# EAGLE schematic ledControlpcb (EAGLE 6.6.0)
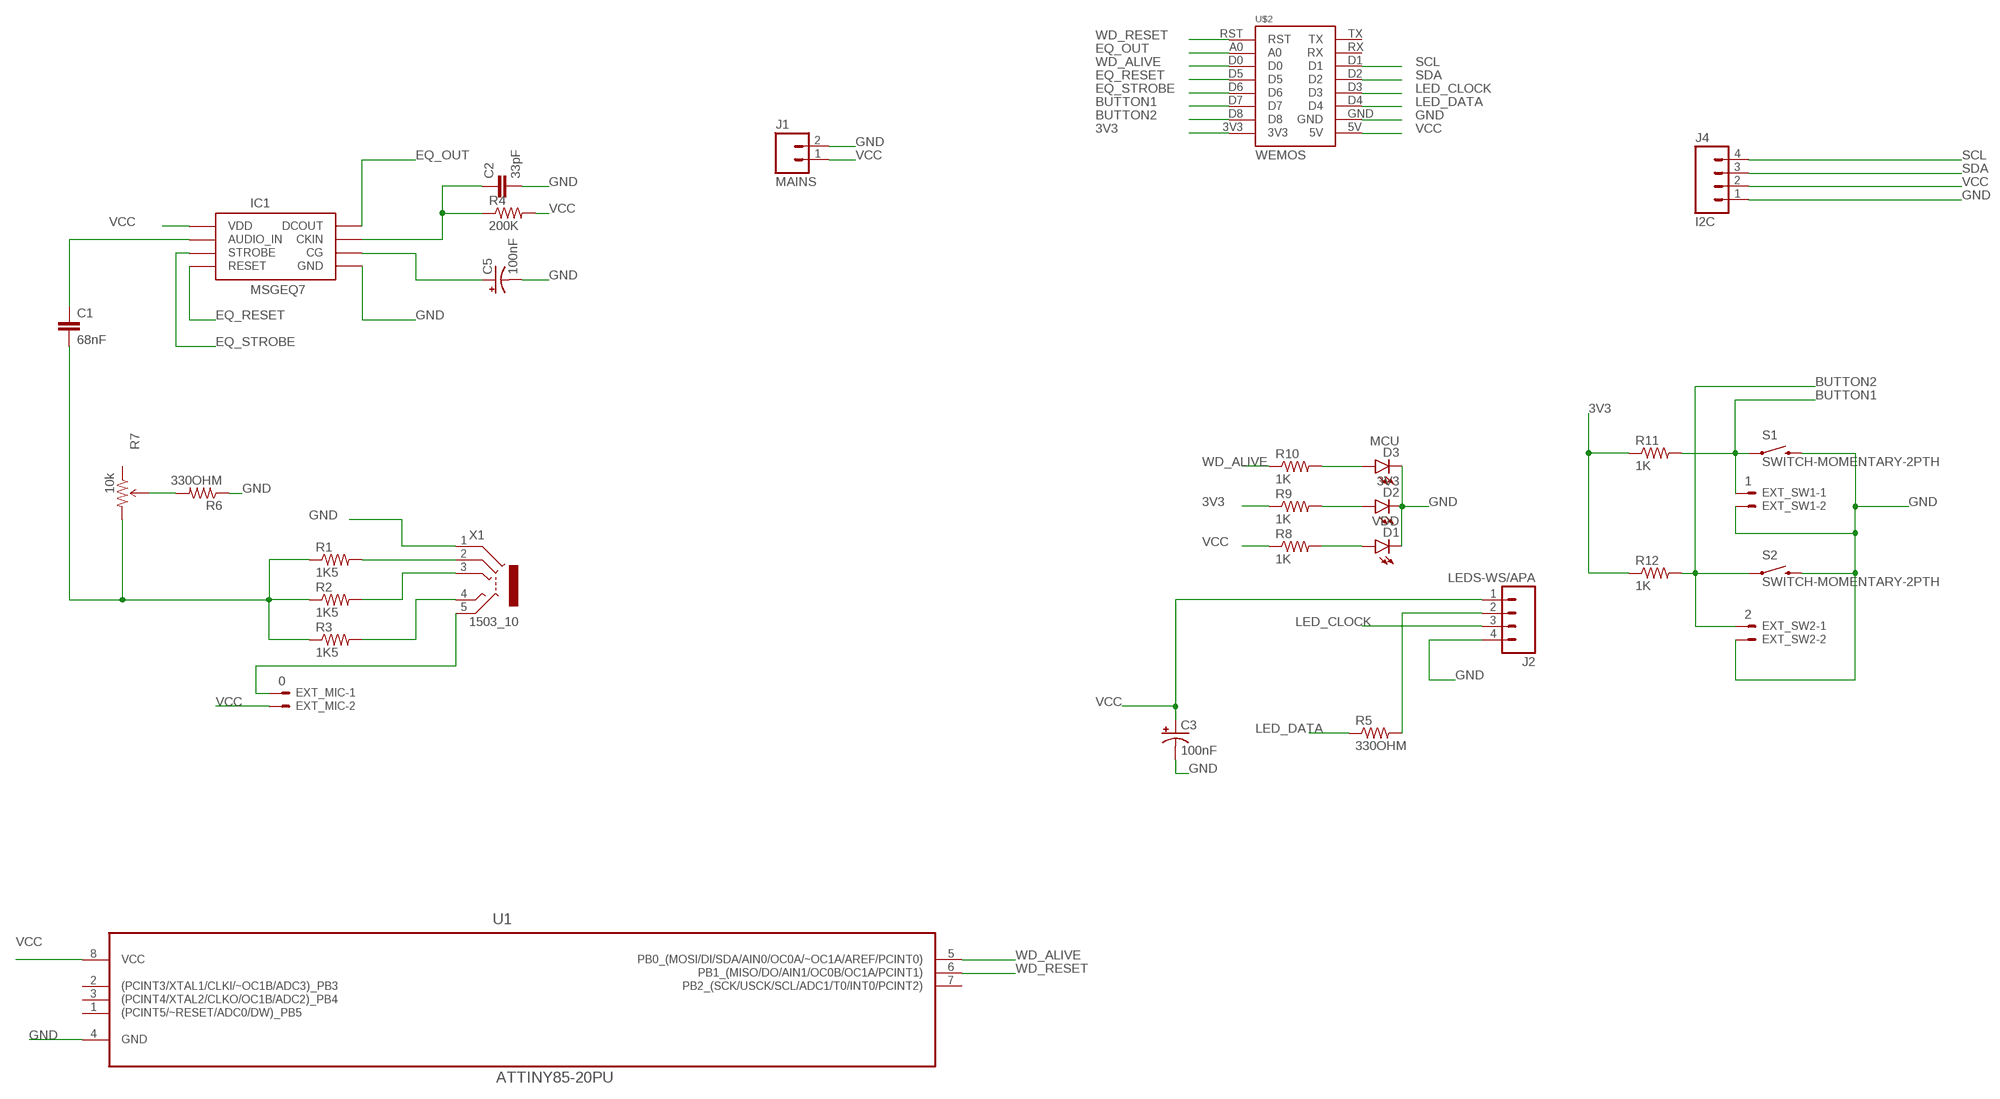
[diagram p0: schematic, sheet 1]

## Parts
C1  68nF  CAP0603-CAP  [0603-CAP]
C2  33pF  CAP0603-CAP  [0603-CAP]
C3  100nF  CAP_POL1206  [EIA3216]
C5  100nF  CAP_POL1206  [EIA3216]
D1  VDD  LED0603  [LED-0603]
D2  3V3  LED0603  [LED-0603]
D3  MCU  LED0603  [LED-0603]
EXT_MIC  0  22-23-2021  [22-23-2021]
EXT_SW1  1  22-23-2021  [22-23-2021]
EXT_SW2  2  22-23-2021  [22-23-2021]
IC1  MSGEQ7DIP  [DIL08]
J1  MAINS  M02POLAR  [MOLEX-1X2]
J2  LEDS-WS/APA  M04POLAR  [MOLEX-1X4]
J4  I2C  M04POLAR  [MOLEX-1X4]
R1  1K5  RESISTOR0603  [0603-RES]
R2  1K5  RESISTOR0603  [0603-RES]
R3  1K5  RESISTOR0603-RES  [0603-RES]
R4  200K  RESISTOR0603  [0603-RES]
R5  330OHM  RESISTOR0603  [0603-RES]
R6  330OHM  RESISTOR0603-RES  [0603-RES]
R7  10k  TRIMPOTPTH  [TRIM_POT_PTH]
R8  1K  RESISTOR0603  [0603-RES]
R9  1K  RESISTOR0603  [0603-RES]
R10  1K  RESISTOR0603  [0603-RES]
R11  1K  RESISTOR0603  [0603-RES]
R12  1K  RESISTOR0603  [0603-RES]
S1  SWITCH-MOMENTARY-2PTH  [TACTILE-PTH]
S2  SWITCH-MOMENTARY-2PTH  [TACTILE-PTH]
U1  ATTINY85-20PU  [DIP254P762X533-8]
U$2  WEMOS  [WEMOS]
X1  1503_10  [1503_10]

## Nets
3V3: R9.1 R11.1 R12.1 U$2.3V3
AUDIO_IN: C1.2 R1.1 R2.1 R3.1 R7.3(CW)
BUTTON1: EXT_SW1.1 R11.2 S1.1 U$2.D7
BUTTON2: EXT_SW2.1 R12.2 S2.1 U$2.D8
EQ_OUT: IC1.3(DCOUT) U$2.A0
EQ_RESET: IC1.7(RESET) U$2.D5
EQ_STROBE: IC1.4(STROBE) U$2.D6
GND: C2.2 C3.C(-) C5.C(-) D1.C D2.C D3.C EXT_SW1.2 EXT_SW2.2 IC1.2(GND) J1.2 J2.4 J4.1 R6.1 S1.3 S2.3 U1.4(GND) U$2.GND X1.1
LED_CLOCK: J2.3 U$2.D3
LED_DATA: R5.1 U$2.D4
N$1: R1.2 X1.2
N$2: R2.2 X1.3
N$3: R3.2 X1.4
N$4: C1.1 IC1.5(AUDIO_IN)
N$5: R6.2 R7.2(WIPER)
N$6: D3.A R10.2
N$7: C5.A(+) IC1.6(CG)
N$8: C2.1 IC1.8(CKIN) R4.1
N$9: D2.A R9.2
N$10: J2.2 R5.2
N$11: D1.A R8.2
N$12: EXT_MIC.1 X1.5
SCL: J4.4 U$2.D1
SDA: J4.3 U$2.D2
VCC: C3.A(+) EXT_MIC.2 IC1.1(VDD) J1.1 J2.1 J4.2 R4.2 R8.1 U1.8(VCC) U$2.5V
WD_ALIVE: R10.1 U1.5(PB0_(MOSI/DI/SDA/AIN0/OC0A/~OC1A/AREF/PCINT0)) U$2.D0
WD_RESET: U1.6(PB1_(MISO/DO/AIN1/OC0B/OC1A/PCINT1)) U$2.RST
Unconnected: R7.1(CCW) U1.1((PCINT5/~RESET/ADC0/DW)_PB5) U1.2((PCINT3/XTAL1/CLKI/~OC1B/ADC3)_PB3) U1.3((PCINT4/XTAL2/CLKO/OC1B/ADC2)_PB4) U1.7(PB2_(SCK/USCK/SCL/ADC1/T0/INT0/PCINT2)) U$2.RX U$2.TX

## Library data of the parts
C1 C2 = SparkFun-Capacitors:CAP: Capacitor Standard 0603 ceramic capacitor, and 0.1" leaded capacitor.
C3 C5 = SparkFun-Capacitors:CAP_POL: Capacitor Polarized These are standard SMD and PTH capacitors. Normally 10uF, 47uF, and 100uF in electrolytic and tantalum varieties. Always verify the external diameter of the through hole cap, it varies with capacity, voltage, and manufacturer. The EIA devices should be standard.
D1-D3 = SparkFun-LED:LED: LEDs Standard schematic elements and footprints for 5mm, 3mm, 1206, and 0603 sized LEDs. 5mm - Spark Fun Electronics SKU : COM-00529 (and others)
EXT_MIC EXT_SW1 EXT_SW2 = con-molex:22-23-2021: .100" (2.54mm) Center Header - 2 Pin; MF: MOLEX; MPN: 22-23-2021; OC_FARNELL: 1462926; OC_NEWARK: 25C3832
IC1 = msgeq7:MSGEQ7: 7-band graphic equalizer
J1 = SparkFun-Connectors:M02: Standard 2-pin 0.1" header. Use with - straight break away headers ( PRT-00116) - right angle break away headers (PRT-00553) - swiss pins (PRT-00743) - machine pins (PRT-00117) - female headers (PRT-00115) Molex polarized connector foot print use with: PRT-08233 with associated crimp pins and housings. 2.54_SCREWTERM for use with PRT-10571. 3.5mm Screw Terminal footprints for PRT-08084 5mm Screw Terminal footprints for use with PRT-08432
J2 J4 = SparkFun-Connectors:M04: Header 4 Standard 4-pin 0.1" header. Use with straight break away headers (SKU : PRT-00116), right angle break away headers (PRT-00553), swiss pins (PRT-00743), machine pins (PRT-00117), and female headers (PRT-00115). Molex polarized connector foot print use with SKU : PRT-08231 with associated crimp pins and housings. 1MM SMD Version SKU: PRT-10208
R1-R6 R8-R12 = SparkFun-Resistors:RESISTOR: Resistor Basic schematic elements and footprints for 0603, 1206, and PTH resistors.
R7 = SparkFun-Electromechanical:TRIMPOT: Various small potentiometers for "set-and-forget" applications
S1 S2 = SparkFun-Electromechanical:SWITCH-MOMENTARY-2: Various NO switches- pushbuttons, reed, etc; PROD_ID: SWCH-08441
U1 = AtTiny85:ATTINY85-20PU: 8-bit Microcontroller with In-System Programmable Flash; MPN: ATTINY85-20PU; OC_FARNELL: 1455162; OC_NEWARK: 58M3796; PACKAGE: PDIP-8; SUPPLIER: Atmel
U$2 = wemosD1:WEMOS
X1 = con-lumberg:1503_10: Jack connectors according to JISC 6560, 3.5 mm Klinkeneinbaukupplung, 3,5 mm, 4-polig/stereo, abgewinkelte Ausführung Source: http://www.lumberg.de/Produkte/PDFs/1503_10.pdf; OC_FARNELL: 1308868; OC_NEWARK: unknown